# EAGLE design encoder_rs485 (EAGLE 9.6.2)
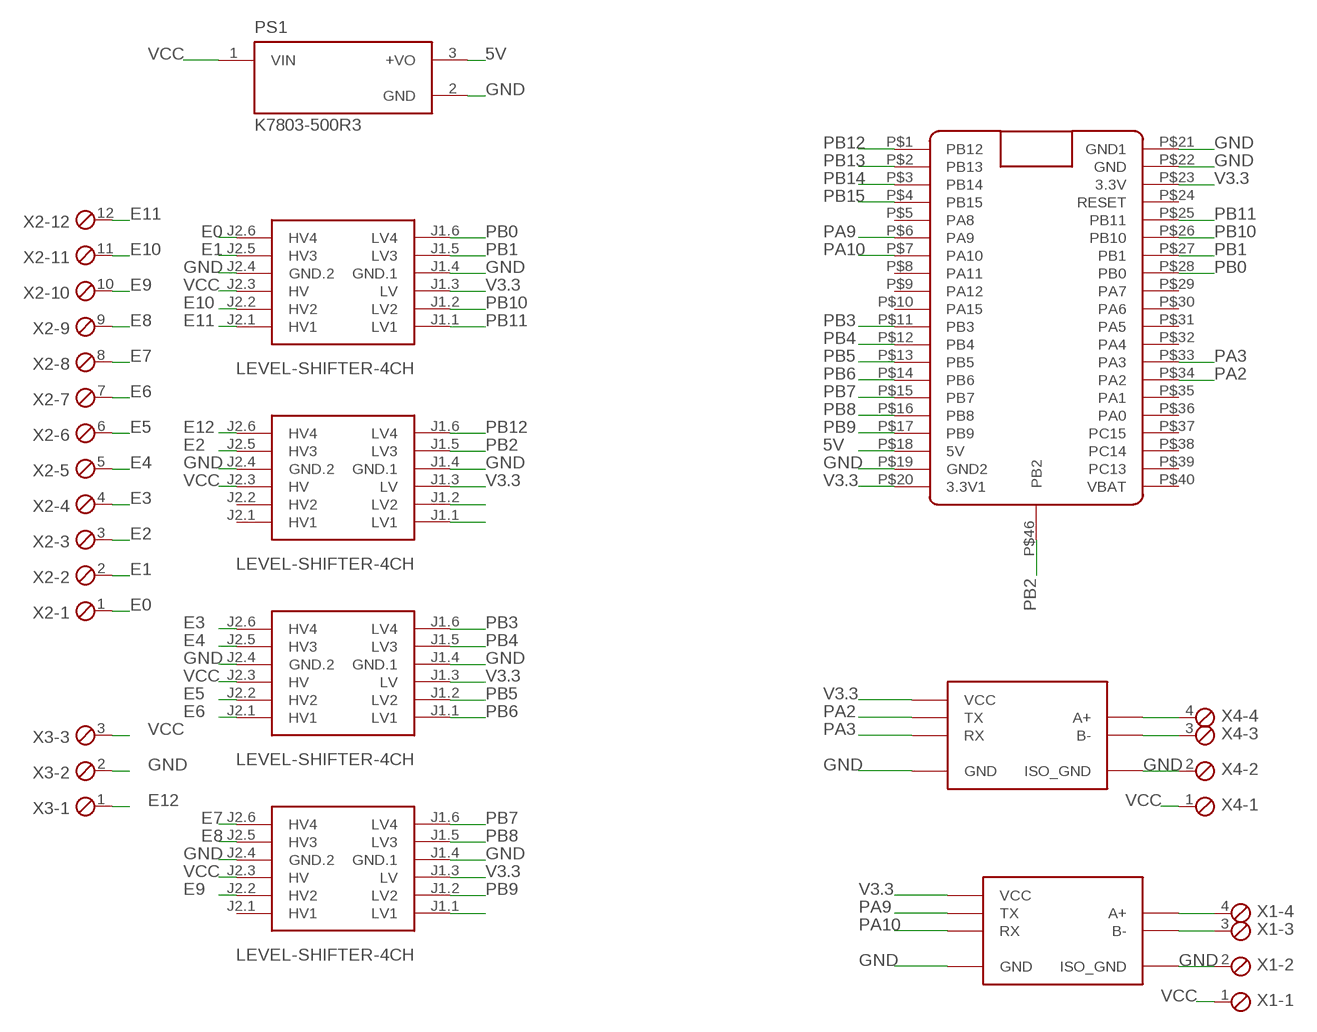
[diagram p0: schematic, sheet 1]

## Parts
PS1  K7803-500R3  [CONV_K7803-500R3]
U$1  LIMNOTECH_SMC_RS485  [LIMNOTECH_SMC_RS485]
U$2  LEVEL-SHIFTER-4CH  [LEVEL-SHIFTER-4CH]
U$3  LEVEL-SHIFTER-4CH  [LEVEL-SHIFTER-4CH]
U$4  LEVEL-SHIFTER-4CH  [LEVEL-SHIFTER-4CH]
U$5  LEVEL-SHIFTER-4CH  [LEVEL-SHIFTER-4CH]
U$6  BLUE_PILLADVANCED  [BLUE_PILL_ADV]
U$7  LIMNOTECH_SMC_RS485  [LIMNOTECH_SMC_RS485]
X1  MKDS1/4-3,81  [4POL381]
X2  MKDS1/12-3,81  [12POL381]
X3  MKDS1/3-3,81  [3POL381]
X4  MKDS1/4-3,81  [4POL381]

## Nets
5V: PS1.3(+VO) U$6.P$18(5V)
E0: U$2.J2.6(HV4) X2.1
E1: U$2.J2.5(HV3) X2.2
E2: U$3.J2.5(HV3) X2.3
E3: U$4.J2.6(HV4) X2.4
E4: U$4.J2.5(HV3) X2.5
E5: U$4.J2.2(HV2) X2.6
E6: U$4.J2.1(HV1) X2.7
E7: U$5.J2.6(HV4) X2.8
E8: U$5.J2.5(HV3) X2.9
E9: U$5.J2.2(HV2) X2.10
E10: U$2.J2.2(HV2) X2.11
E11: U$2.J2.1(HV1) X2.12
E12: U$3.J2.6(HV4) X3.1
GND: PS1.2(GND) U$1.GND U$1.GND_ISO(ISO_GND) U$2.J1.4(GND.1) U$2.J2.4(GND.2) U$3.J1.4(GND.1) U$3.J2.4(GND.2) U$4.J1.4(GND.1) U$4.J2.4(GND.2) U$5.J1.4(GND.1) U$5.J2.4(GND.2) U$6.P$19(GND2) U$6.P$21(GND1) U$6.P$22(GND) U$7.GND U$7.GND_ISO(ISO_GND) X1.2 X3.2 X4.2
N$3: U$1.B- X1.3
N$4: U$1.A+ X1.4
N$6: U$7.B- X4.3
N$7: U$7.A+ X4.4
N$15: U$3.J1.2(LV2)
N$16: U$3.J1.1(LV1)
N$28: U$5.J1.1(LV1)
PA2: U$6.P$34(PA2) U$7.TX
PA3: U$6.P$33(PA3) U$7.RX
PA9: U$1.TX U$6.P$6(PA9)
PA10: U$1.RX U$6.P$7(PA10)
PB0: U$2.J1.6(LV4) U$6.P$28(PB0)
PB1: U$2.J1.5(LV3) U$6.P$27(PB1)
PB2: U$3.J1.5(LV3) U$6.P$46(PB2)
PB3: U$4.J1.6(LV4) U$6.P$11(PB3)
PB4: U$4.J1.5(LV3) U$6.P$12(PB4)
PB5: U$4.J1.2(LV2) U$6.P$13(PB5)
PB6: U$4.J1.1(LV1) U$6.P$14(PB6)
PB7: U$5.J1.6(LV4) U$6.P$15(PB7)
PB8: U$5.J1.5(LV3) U$6.P$16(PB8)
PB9: U$5.J1.2(LV2) U$6.P$17(PB9)
PB10: U$2.J1.2(LV2) U$6.P$26(PB10)
PB11: U$2.J1.1(LV1) U$6.P$25(PB11)
PB12: U$3.J1.6(LV4) U$6.P$1(PB12)
PB13: U$6.P$2(PB13)
PB14: U$6.P$3(PB14)
PB15: U$6.P$4(PB15)
V3.3: U$1.VCC U$2.J1.3(LV) U$3.J1.3(LV) U$4.J1.3(LV) U$5.J1.3(LV) U$6.P$20(3.3V1) U$6.P$23(3.3V) U$7.VCC
VCC: PS1.1(VIN) U$2.J2.3(HV) U$3.J2.3(HV) U$4.J2.3(HV) U$5.J2.3(HV) X1.1 X3.3 X4.1
Unconnected: U$3.J2.1(HV1) U$3.J2.2(HV2) U$5.J2.1(HV1) U$6.P$5(PA8) U$6.P$8(PA11) U$6.P$9(PA12) U$6.P$10(PA15) U$6.P$24(RESET) U$6.P$29(PA7) U$6.P$30(PA6) U$6.P$31(PA5) U$6.P$32(PA4) U$6.P$35(PA1) U$6.P$36(PA0) U$6.P$37(PC15) U$6.P$38(PC14) U$6.P$39(PC13) U$6.P$40(VBAT)

## Library data of the parts
PS1 = K7803-500R3:K7803-500R3: DC/DC Converter Check availability <https://pricing.snapeda.com/parts/K7803-500R3/Mornsun%20America%2C%20LLC/view-part?ref=eda>; AVAILABILITY: In Stock; DESCRIPTION: Non-Isolated PoL Module DC DC Converter 1 Output 3.3V, -3.3V - - - 500mA, 300mA 4.75V, 7V - 36V, 32V Input; MF: Mornsun America, LLC; MP: K7803-500R3; PACKAGE: SIP-3-3 MORNSUN; PRICE: None; PURCHASE-URL: https://pricing.snapeda.com/search/part/K7803-500R3/?ref=eda
U$1 U$7 = aamilibreria:LIMNOTECH_SMC_RS485: Layout for connecting SMC RS-485 module Module <https://www.amazon.com/SMAKN%C2%AE-Adapter-Serial-Converter-Module/dp/B010723BCE>
U$2-U$5 = diy-modules:LEVEL-SHIFTER-4CH: 4-Channel Bi-Directional Logic Level Converter based on BSS128 transistors Click here to find device on ebay.com <http://www.ebay.com/sch/i2c+logic+converter+module>
U$6 = BluePill:BLUE_PILL
X1 X4 = con-phoenix-381:MKDS1/4-3,81: MKDS 1/4-3,81 - Order No. 1727036 Pitch: 3,81mm Number of terminals: 4 Rated Voltage: 160V Maximum load current/ cross section: 12A/1.5mm2-AWG16 Housing Interlocking: none Color: Green
X2 = con-phoenix-381:MKDS1/12-3,81: MKDS 1/12-3,81 - Order No. 1727117 Pitch: 3,81mm Number of terminals: 12 Rated Voltage: 160V Maximum load current/ cross section: 12A/1.5mm2-AWG16 Housing Interlocking: none Color: Green
X3 = con-phoenix-381:MKDS1/3-3,81: MKDS 1/3-3,81 - Order No. 1727023 (RS-Online - 101-5390) Pitch: 3,81mm Number of terminals: 3 Rated Voltage: 160V Maximum load current/ cross section: 12A/1.5mm2-AWG16 Housing Interlocking: none Color: Green

## Board
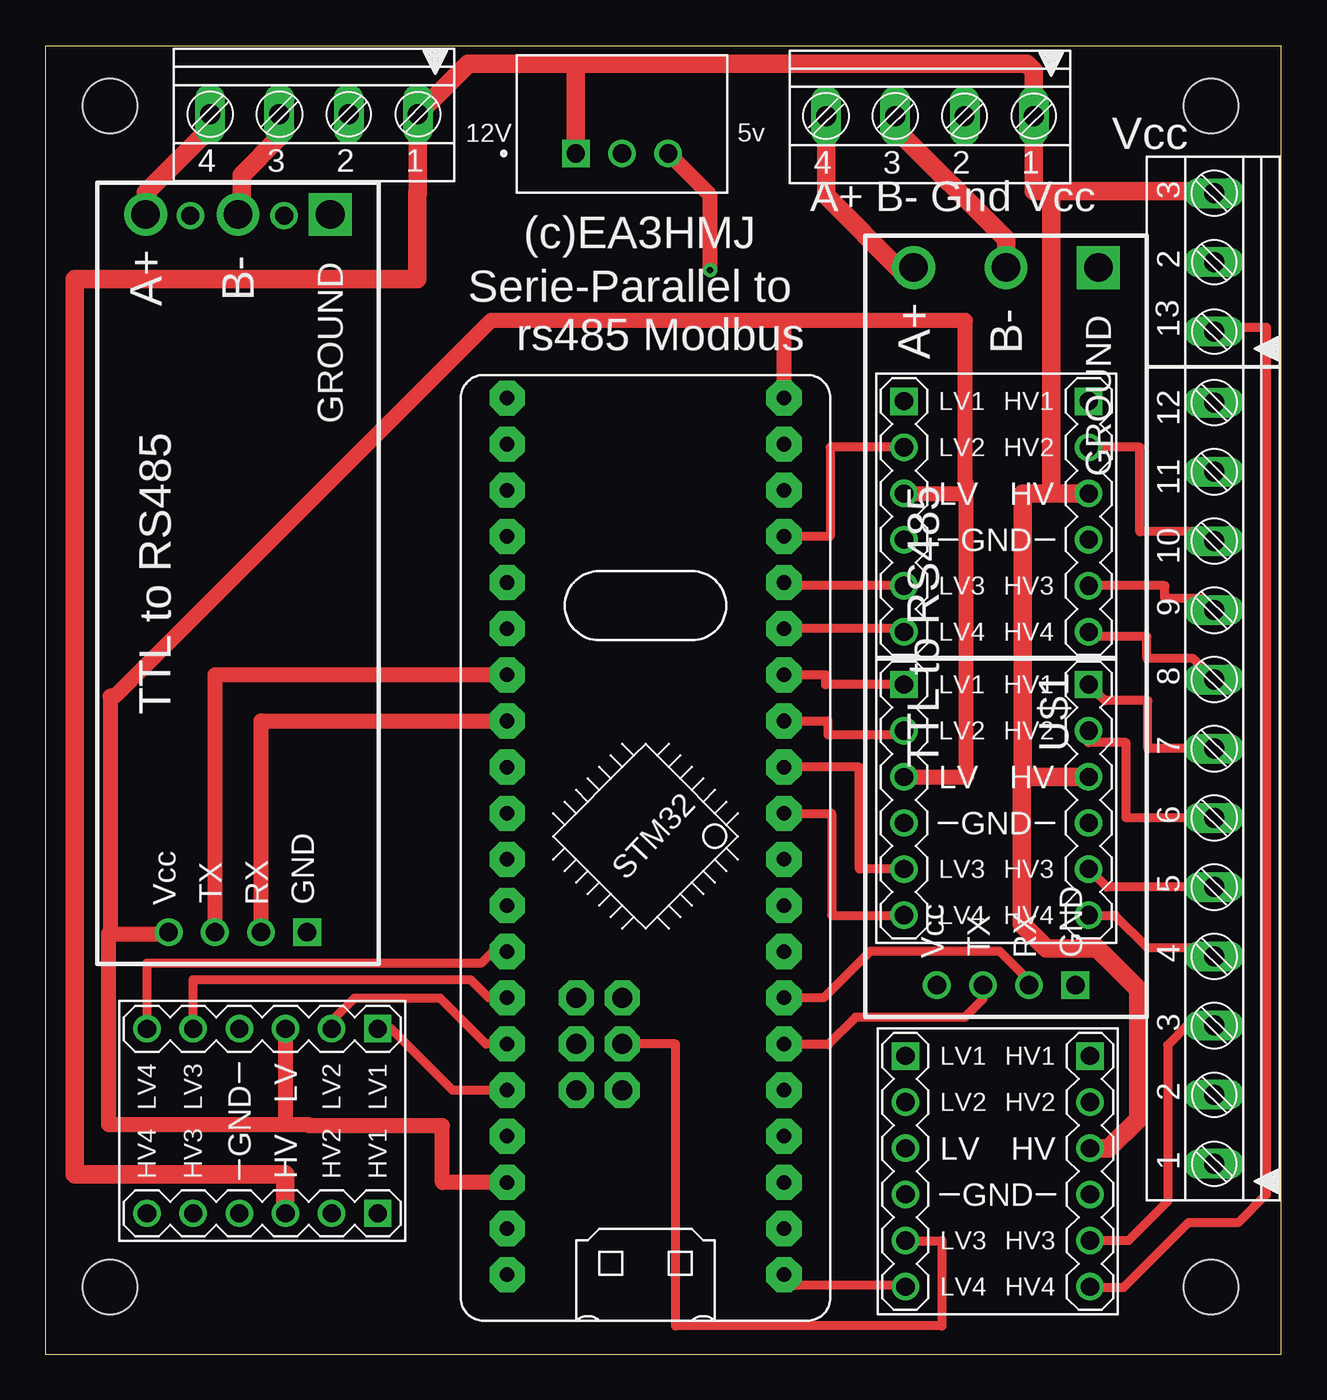
[diagram p1: board, top side]
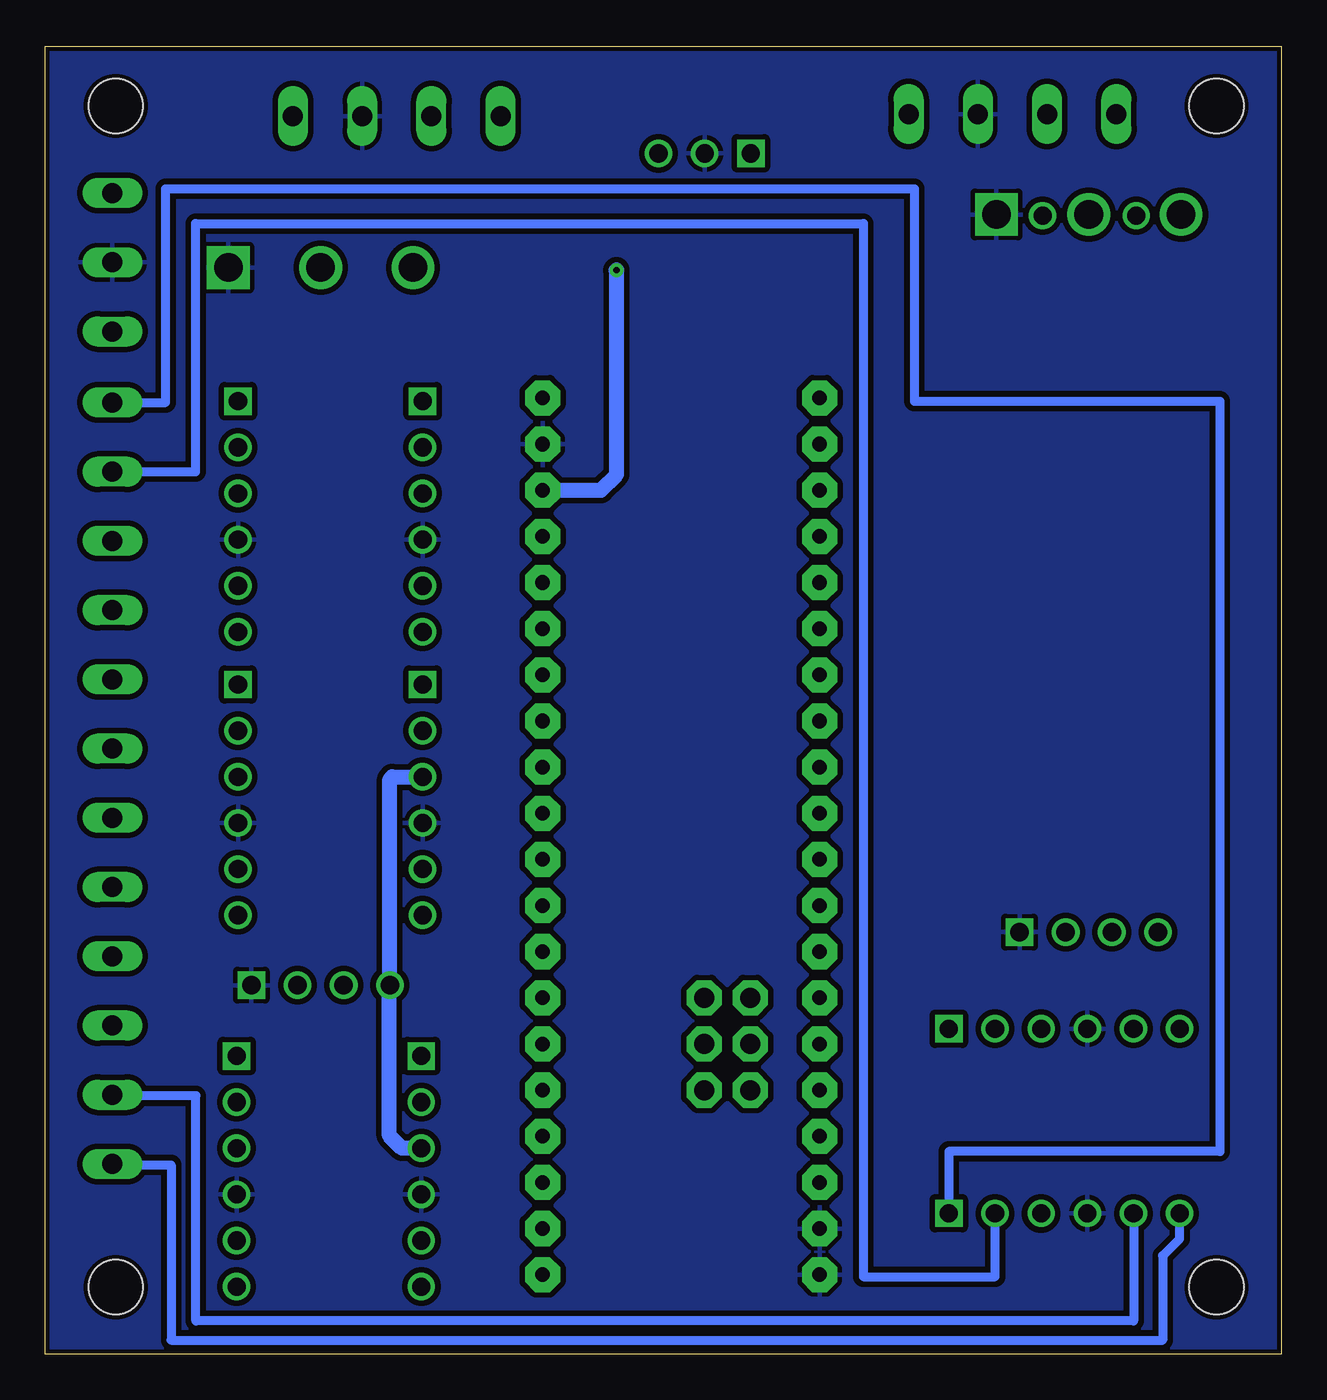
[diagram p2: board, bottom side, seen from below]

Size 68 x 72 mm. Coordinates in mm from the lower left corner, seen from the top.
Outline: 0,0 68,0 68,72 0,72 0,0
Copper layers (1*16): Top 0.035mm / dielectric 1.5mm / Bottom 0.035mm
Design rules "default *": minimum track width 6mil, minimum drill 0.35mm, track to track 12mil, track to pad 12mil, pad to pad 12mil, via to via 12mil, smd to smd 12mil, copper to edge 10mil, drill to drill 6mil, minimum pad ring 10mil, minimum via ring 8mil, stop-mask expansion 4mil, vias tented up to drill 0mil, thermal gap 10mil
Holes 3 mm at 3.56,68.71 64.14,68.71 64.14,3.68 3.56,3.68

### Footprints (pad centres in the part's own frame; a part is rotated, then mirrored left to right if it is on the bottom)
CONV_K7803-500R3 = drill 1 square: 1 -2.54,-1.625 | drill 1: 2 0,-1.625; 3 2.54,-1.625
LIMNOTECH_SMC_RS485 = drill 1.57: A+ 19.75,5.08; B- 19.75,0 | drill 1.016 square: GND -19.75,-3.81 | drill 1.57 square: GND_ISO 19.75,-5.08 | drill 1.016: RX -19.75,-1.27; TX -19.75,1.27; VCC -19.75,3.81
LEVEL-SHIFTER-4CH = drill 1 square: J1.1 -5.08,6.35; J2.1 5.08,6.35 | drill 1: J1.2 -5.08,3.81; J1.3 -5.08,1.27; J1.4 -5.08,-1.27; J1.5 -5.08,-3.81; J1.6 -5.08,-6.35; J2.2 5.08,3.81; J2.3 5.08,1.27; J2.4 5.08,-1.27; J2.5 5.08,-3.81; J2.6 5.08,-6.35
BLUE_PILL_ADV = drill 0.8 pad 1.93 octagon: P$1 10.16,-30.48; P$2 10.16,-27.94; P$3 10.16,-25.4; P$4 10.16,-22.86; P$5 10.16,-20.32; P$6 10.16,-17.78; P$7 10.16,-15.24; P$8 10.16,-12.7; P$9 10.16,-10.16; P$10 10.16,-7.62; P$11 10.16,-5.08; P$12 10.16,-2.54; P$13 10.16,0; P$14 10.16,2.54; P$15 10.16,5.08; P$16 10.16,7.62; P$17 10.16,10.16; P$18 10.16,12.7; P$19 10.16,15.24; P$20 10.16,17.78; P$21 -5.08,-30.48; P$22 -5.08,-27.94; P$23 -5.08,-25.4; P$24 -5.08,-22.86; P$25 -5.08,-20.32; P$26 -5.08,-17.78; P$27 -5.08,-15.24; P$28 -5.08,-12.7; P$29 -5.08,-10.16; P$30 -5.08,-7.62; P$31 -5.08,-5.08; P$32 -5.08,-2.54; P$33 -5.08,0; P$34 -5.08,2.54; P$35 -5.08,5.08; P$36 -5.08,7.62; P$37 -5.08,10.16; P$38 -5.08,12.7; P$39 -5.08,15.24; P$40 -5.08,17.78 | drill 1.1 pad 1.93 octagon: P$42 -1.27,-20.32; P$43 -1.27,-17.78; P$44 -1.27,-15.24; P$45 1.27,-15.24; P$46 1.27,-17.78; P$47 1.27,-20.32
4POL381 = drill 1.1 long: 1 0,0; 2 3.81,0; 3 7.62,0; 4 11.43,0
12POL381 = drill 1.1 long: 1 0,0; 2 3.81,0; 3 7.62,0; 4 11.43,0; 5 15.24,0; 6 19.05,0; 7 22.86,0; 8 26.67,0; 9 30.48,0; 10 34.29,0; 11 38.1,0; 12 41.91,0
3POL381 = drill 1.1 long: 1 0,0; 2 3.81,0; 3 7.62,0

### Placement (x,y rotation side)
PS1  31.72,67.72 0 top
U$1  52.86,40.06 90 top
U$2  11.94,12.83 270 top
U$3  52.4,10.06 0 top
U$4  52.32,30.51 0 top
U$5  52.32,46.1 0 top
U$6  30.48,34.85 0 top
U$7  10.59,42.98 90 top
X1  54.38,68.15 180 top
X2  64.31,10.46 90 top
X3  64.31,56.29 90 top
X4  20.5,68.25 180 top

### Tracks (layer width: path | path; a pad name or v marks a point on that pad's centre or on a via)
5V  (via drill 0.35)
  Top 0.813: v36.58,59.66 36.58,63.78 PS1.3
  Bottom 0.813: U$6.P$18 37.44,47.55 36.58,48.41 36.58,59.61 36.6,59.64 v36.58,59.66
E0
  Bottom 0.508: X2.1 64.24,10.41 61.09,10.41 61.09,0.76 6.53,0.76 6.53,5.41 5.59,6.35 U$2.J2.6
E1
  Bottom 0.508: U$2.J2.5 8.13,1.83 59.72,1.83 59.72,14.22 64.29,14.22 X2.2
E2
  Top 0.508: X2.3 62.84,18.09 61.75,16.99 61.75,8.41 59.59,6.25 U$3.J2.5
E3
  Top 0.508: X2.4 63.86,22.35 60.66,22.35 58.85,24.16 U$4.J2.6
E4
  Top 0.508: X2.5 58.4,25.7 U$4.J2.5
E5
  Top 0.508: X2.6 59.46,29.52 59.46,33.66 57.4,33.66 U$4.J2.2
E6
  Top 0.508: X2.7 60.66,33.33 60.66,35.97 58.29,35.97 U$4.J2.1
E7
  Top 0.508: X2.8 63.17,38.28 60.6,38.28 60.6,39.5 57.66,39.5 U$5.J2.6
E8
  Top 0.508: X2.9 63.68,41.58 61.59,41.58 61.59,42.29 U$5.J2.5
E9
  Top 0.508: X2.10 63.8,45.26 60.22,45.26 60.22,49.91 U$5.J2.2
E10
  Bottom 0.508: X2.11 59.74,48.56 59.74,62.23 22.99,62.23 22.99,4.27 15.75,4.27 U$2.J2.2
E11
  Bottom 0.508: X2.12 61.39,52.38 61.39,64.14 20.19,64.14 20.19,52.45 3.38,52.45 3.38,11.15 18.29,11.15 U$2.J2.1
E12
  Top 0.508: X3.1 64.53,56.5 67.18,56.5 67.18,8.79 65.63,7.24 62.89,7.24 59.31,3.66 57.53,3.66 U$3.J2.6
GND
  pour Bottom: 0.13,0.13 67.69,0.13 67.69,72.26 0.13,72.26
N$1  (via drill 1)
  other vias: 7.98,62.66
N$2  (via drill 1)
  other vias: 13.13,62.66
N$3
  Top 1.016: X1.3 46.76,67.46 52.86,61.37 U$1.B-
N$4
  Top 1.016: X1.4 42.95,63.75 47.09,59.61 47.59,59.61 U$1.A+
N$6
  Top 1.016: X4.3 12.88,66.98 10.79,64.9 10.79,62.23 10.59,62.23 U$7.B-
N$7
  Top 1.016: X4.4 9.07,67.49 5.51,63.93 U$7.A+
PA2
  Top 0.813: U$6.P$34 9.32,37.39 U$7.TX
PA3
  Top 0.813: U$7.RX 11.86,34.85 U$6.P$33
PA9
  Top 0.508: U$1.TX 51.59,19.53 50.6,18.54 44.58,18.54 43.08,17.04 40.66,17.04 U$6.P$6
PA10
  Top 0.508: U$1.RX 54.13,20.55 52.5,22.17 45.39,22.17 42.82,19.61 U$6.P$7
PB0
  Top 0.508: U$6.P$28 24.61,22.15 23.98,21.51 5.59,21.51 U$2.J1.6
PB1
  Top 0.508: U$2.J1.5 8.13,20.6 23.39,20.6 24.38,19.61 U$6.P$27
PB2
  Top 0.508: U$3.J1.5 49.33,6.25 49.33,1.55 34.67,1.55 34.67,17.07 U$6.P$46
PB3
  Top 0.508: U$6.P$11 43.26,29.77 43.26,24.16 U$4.J1.6
PB4
  Top 0.508: U$4.J1.5 44.78,26.7 44.78,32.31 U$6.P$12
PB5
  Top 0.508: U$6.P$13 43.05,34.85 43.05,34.09 47.02,34.09 U$4.J1.2
PB6
  Top 0.508: U$4.J1.1 42.93,36.85 42.93,37.39 U$6.P$14
PB7
  Top 0.508: U$5.J1.6 47.07,39.93 U$6.P$15
PB8
  Top 0.508: U$5.J1.5 40.82,42.29 U$6.P$16
PB9
  Top 0.508: U$5.J1.2 43.18,49.91 43.18,45.01 U$6.P$17
PB10
  Top 0.508: U$6.P$26 24.23,17.07 21.72,19.58 16.99,19.58 15.75,18.34 U$2.J1.2
PB11
  Top 0.508: U$6.P$25 22.4,14.53 19.02,17.91 U$2.J1.1
PB12
  Top 0.508: U$6.P$1 41.22,3.79 47.32,3.79 U$3.J1.6
V3.3
  Top 0.508: 6.78,23.14 U$7.VCC
  Top 0.813: U$5.J1.3 50.62,47.37 50.62,47.93 | 50.62,47.93 50.67,47.93 50.67,31.77 U$4.J1.3 | U$2.J1.3 13.21,12.62 | 3.56,23.14 3.48,23.14 3.48,12.62 13.21,12.62 | 3.56,23.14 6.78,23.14 | 13.21,12.62 14.48,12.62 14.48,12.57 21.84,12.57 21.84,9.45 U$6.P$23 | 50.62,47.93 50.62,56.9 44.83,56.9 44.32,56.9 40.72,56.9 | 40.72,56.9 24.51,56.9 3.83,36.22 3.56,36.22 3.56,23.14 | U$6.P$20 40.64,56.82 40.72,56.9
  Bottom 0.813: U$4.J1.3 48.92,31.77 49.05,31.65 U$1.VCC 49.07,20.28 49.07,12.01 48.39,11.33 U$3.J1.3
VCC
  Top 0.152: 55.35,47.37 55.37,47.37
  Top 1.016: 20.5,63.91 X4.1 23.27,71.02 29.18,71.02 | 20.5,63.91 20.5,63.86 | 20.5,63.91 20.45,63.91 20.45,59.18 1.6,59.18 1.6,9.88 13.21,9.88 U$2.J2.3 | 53.77,32.13 53.77,31.77 U$4.J2.3 | 53.77,32.13 53.77,47.37 55.37,47.37 U$5.J2.3 | 53.77,32.13 53.72,32.13 | 55.35,64.01 54.38,64.01 X1.1 54.38,70.64 54,71.02 29.18,71.02 | 55.35,64.01 64.21,64.01 X3.3 | U$3.J2.3 58.52,11.33 60.12,12.93 60.12,20.08 57.87,22.34 55.06,22.34 53.72,23.67 53.72,32.08 53.77,32.13 | PS1.1 29.18,71.02 | 55.35,64.01 55.35,47.37

### Text on the board
tNames: 12V | 5v | Vcc | A+ B- Gnd Vcc | (c)EA3HMJ | Serie-Parallel to / rs485 Modbus | 3
Document: +